# EAGLE design spinner (EAGLE 6.2)
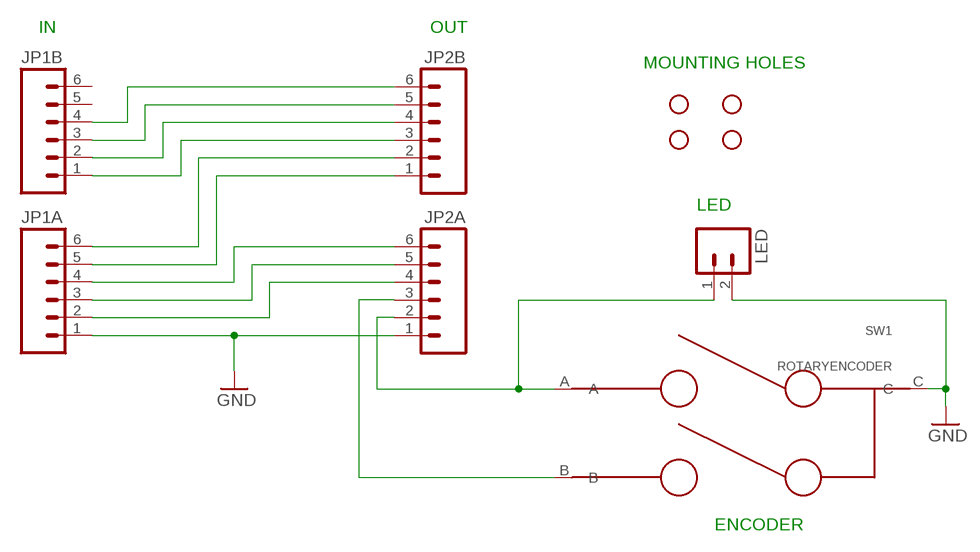
[diagram p0: schematic, sheet 1]

## Parts
JP1A  M06LONGPADS  [1X06_LONGPADS]
JP1B  M06LONGPADS  [1X06_LONGPADS]
JP2A  M06LONGPADS  [1X06_LONGPADS]
JP2B  M06LONGPADS  [1X06_LONGPADS]
JP3  STAND-OFF  [STAND-OFF]
JP4  STAND-OFF  [STAND-OFF]
JP5  STAND-OFF  [STAND-OFF]
JP6  STAND-OFF  [STAND-OFF]
LED  M02PTH3  [1X02_LONGPADS]
SW1  ROTARYENCODER  [EVQV5]

## Nets
GND [ground]: JP1A.1 JP2A.1 LED.2 SW1.C
N$1: JP2A.2 LED.1 SW1.A
N$2: JP1B.4 JP2B.6
N$3: JP1B.3 JP2B.5
N$4: JP1B.2 JP2B.4
N$5: JP1B.1 JP2B.3
N$6: JP1A.6 JP2B.2
N$7: JP1A.5 JP2B.1
N$8: JP1A.4 JP2A.6
N$9: JP1A.3 JP2A.5
N$10: JP1A.2 JP2A.4
N$11: JP2A.3 SW1.B
Unconnected: JP1B.5 JP1B.6

## Notes on the sheet
- IN | OUT
- MOUNTING HOLES
- LED
- ENCODER

## Library data of the parts
JP1A JP1B JP2A JP2B = SparkFun:M06: Header 6 Standard 6-pin 0.1" header. Use with straight break away headers (SKU : PRT-00116), right angle break away headers (PRT-00553), swiss pins (PRT-00743), machine pins (PRT-00117), and female headers (PRT-00115). Molex polarized connector foot print use with SKU : PRT-08094 with associated crimp pins and housings. NOTES ON THE VARIANTS LOCK and LOCK_LONGPADS... This footprint was designed to help hold the alignment of a through-hole component (i.e. 6-pin header) while soldering it into place. You may notice that each hole has been shifted either up or down by 0.005 of an inch from it's more standard position (which is a perfectly straight line). This slight alteration caused the pins (the squares in the middle) to touch the edges of the holes. Because they are alternating, it causes a "brace" to hold the component in place. 0.005 has proven to be the perfect amount of "off-center" position when using our standard breakaway headers. Although looks a little odd when you look at the bare footprint, once you have a header in there, the alteration is very hard to notice. Also, if you push a header all the way into place, it is covered up entirely on the bottom side. This idea of altering the position of holes to aid alignment will be further integrated into the Sparkfun Library for other footprints. It can help hold any component with 3 or more connection pins.
JP3-JP6 = SparkFun:STAND-OFF: Stand Off This is the mechanical footprint for a #4 phillips button head screw. Use the keepout ring to avoid running the screw head into surrounding components. SKU : PRT-00447
LED = SparkFun:M02: Header 2 Standard 2-pin 0.1" header. Use with straight break away headers (SKU : PRT-00116), right angle break away headers (PRT-00553), swiss pins (PRT-00743), machine pins (PRT-00117), and female headers (PRT-00115). Molex polarized connector foot print use with SKU : PRT-08233 with associated crimp pins and housings.
SW1 = spinner:ROTARYENCODER

## Net classes
0 default: width 0.61 mm
1 ground: width 0.813 mm

## Board
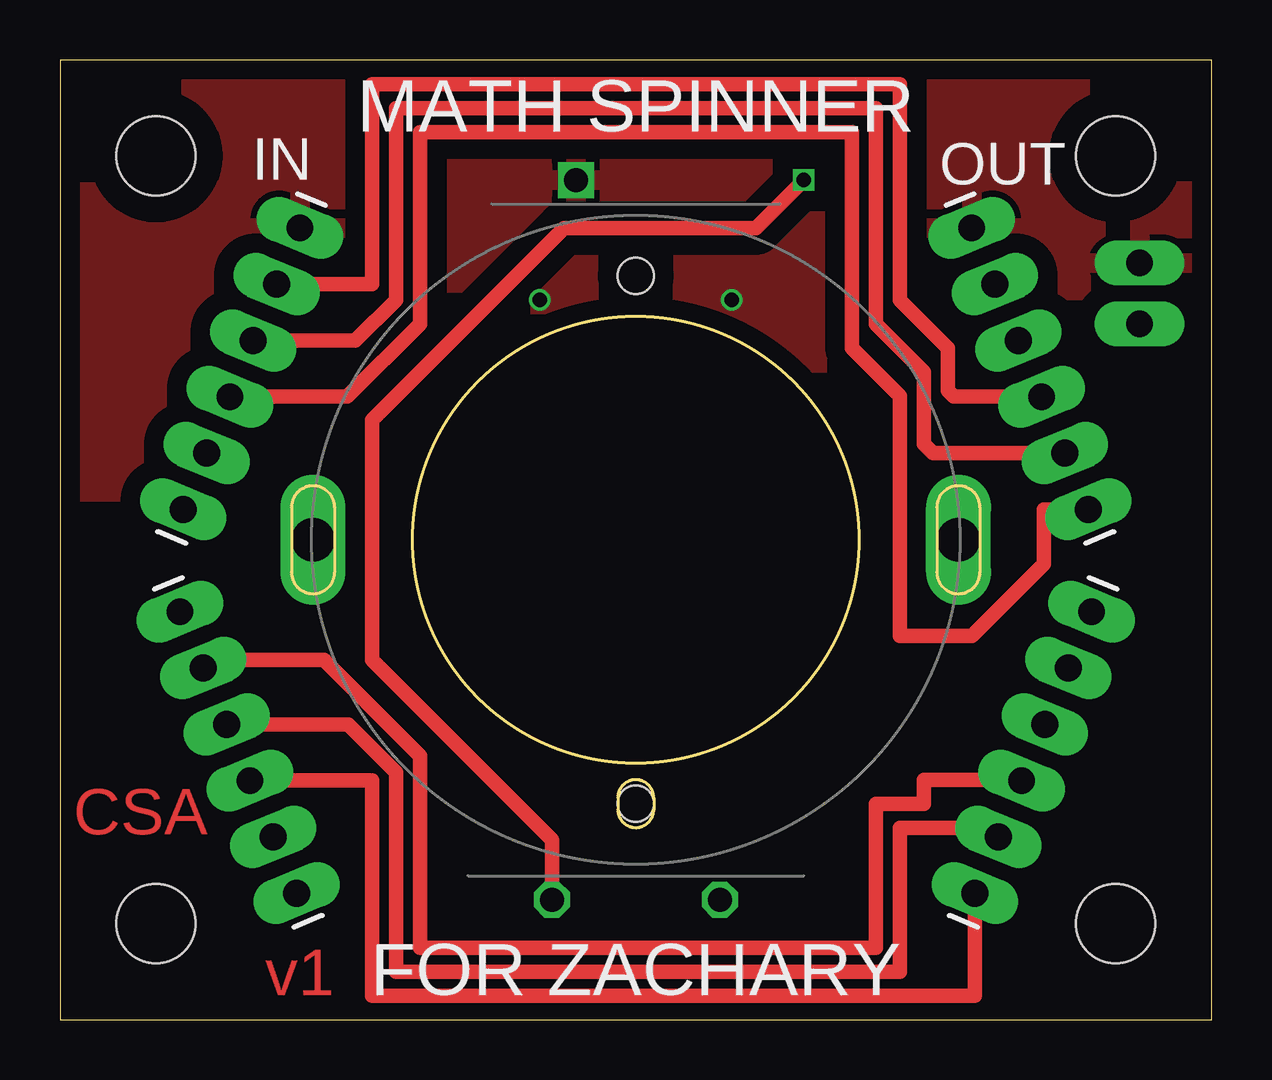
[diagram p1: board, top side]
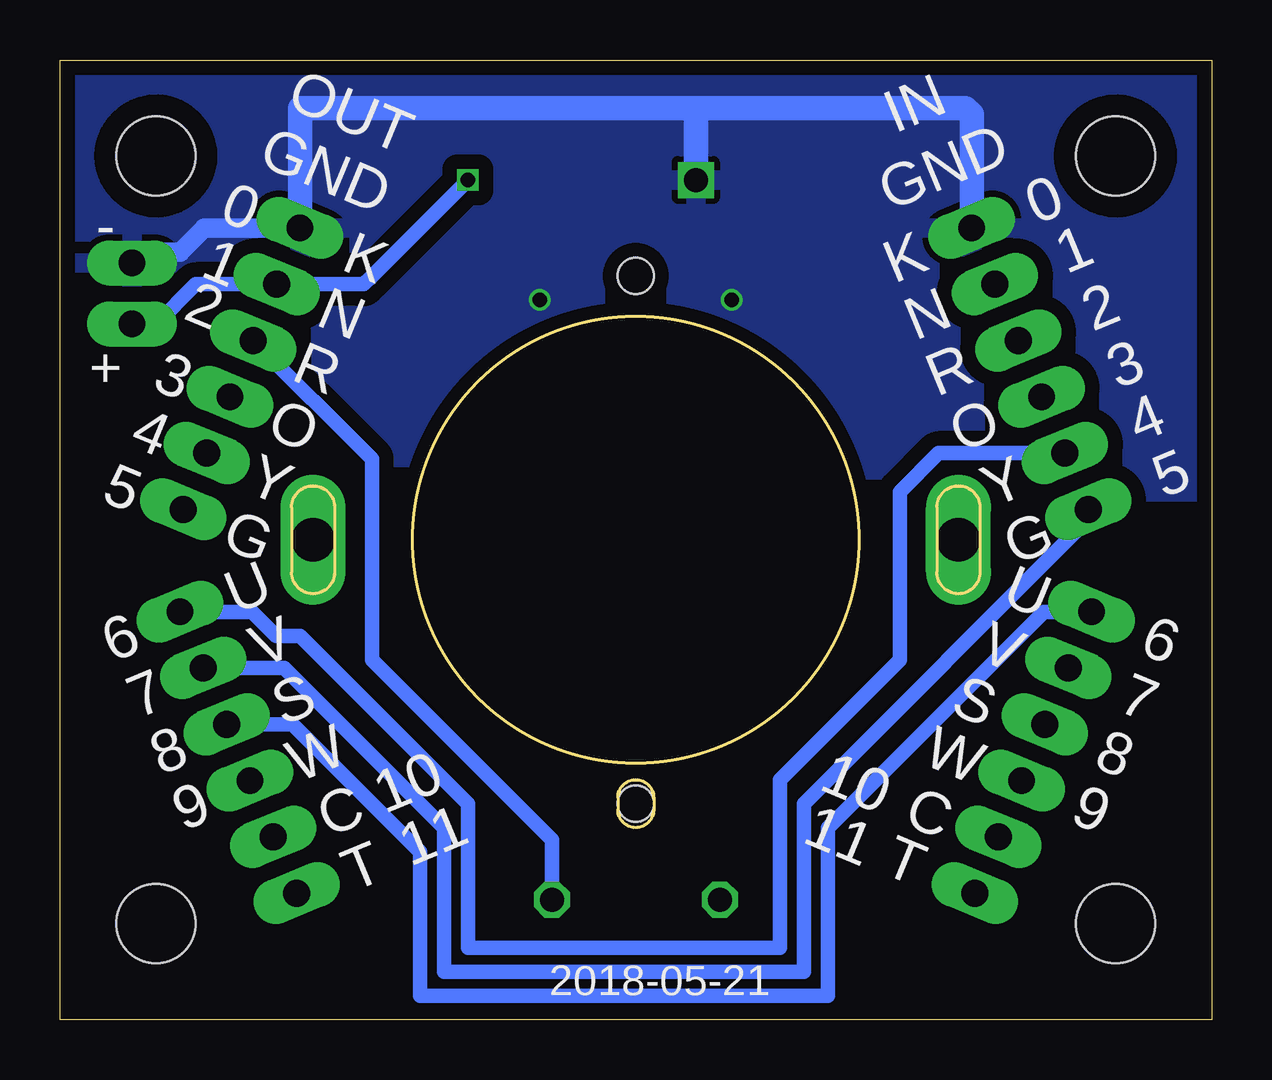
[diagram p2: board, bottom side, seen from below]

Size 48 x 40 mm. Coordinates in mm from the lower left corner, seen from the top.
Outline: 0,0 48,0 48,40 0,40 0,0
Copper layers (1*16): Top 0.035559375mm / dielectric 1.6mm / Bottom 0.035559375mm
Design rules: minimum track width 6mil, minimum drill 10mil, track to track 6mil, track to pad 6mil, pad to pad 6mil, via to via 6mil, smd to smd 6mil, copper to edge 15mil, drill to drill 6mil, minimum pad ring 5mil, minimum via ring 5mil, stop-mask expansion 2.5mil, vias tented up to drill 25mil, thermal gap 10mil
Holes 18.6 mm at 24,20

### Footprints (pad centres in the part's own frame; a part is rotated, then mirrored left to right if it is on the bottom)
1X06_LONGPADS = drill 1.118 pad 1.88 long: 1 0,0; 2 2.54,0; 3 5.08,0; 4 7.62,0; 5 10.16,0; 6 12.7,0
STAND-OFF = hole 3.302: 0,0
1X02_LONGPADS = drill 1.118 pad 1.88 long: 1 0,0; 2 2.54,0
EVQV5 = drill 1 octagon: A -3.5,-15; B 3.5,-15 | drill 1 square: C -2.5,15 | drill 1.8 long: P$1 -13.45,0; P$2 13.45,0 | hole 1.5: 0,11; 0,-11

### Placement (x,y rotation side)
JP1A  10,33 247.5 top
JP1B  5,17 292.5 top
JP2A  38,33 292.5 top
JP2B  43,17 247.5 top
JP3  4,4 0 top
JP4  4,36 0 top
JP5  44,36 0 top
JP6  44,4 0 top
LED  45,29 90 top
SW1  24,20 0 top

### Tracks (layer width: path | path; a pad name or v marks a point on that pad's centre or on a via)
GND  (via drill 0.6)
  Bottom 0.813: JP2A.1 42,33 43,32 44.54,32 LED.2
  Bottom 1.016: SW1.C 21.5,37.75 21.75,38 22,38 | 22,38 38,38 JP2A.1 | JP1A.1 10,37.75 10.25,38 22,38
  other vias: 28,30 20,30
  pour Bottom (isolate 0.61): 0,22 0,40 48,40 48,22
  pour Top (isolate 0.813): 0,22 0,40 48,40 48,22
N$1  (via drill 0.6)
  Top 0.61: SW1.A 20.5,7.5 13,15 13,25 21,33 28,33 29,33 v31,35
  Bottom 0.61: LED.1 44,29 42.35,30.65 JP2A.2 35.35,30.65 35,31 v31,35
N$2
  Top 0.61: JP1B.4 13,9.96 13,1 38.14,1 JP2B.6
N$3
  Top 0.61: JP2B.5 39.11,8 35,8 35,2 14,2 14,10.31 12,12.31 JP1B.3
N$4
  Top 0.61: JP2B.4 40.08,10 36,10 36,9 34,9 34,3 15,3 15,11 13,13 11,15 6.32,15 JP1B.2
N$5
  Bottom 0.61: JP1B.1 7,17 9,15 16,8 16,1 33,1 33,7 38,12 38.31,12.31 JP2B.3
N$6
  Bottom 0.61: JP1A.6 5.14,20.86 17,9 17,2 32,2 32,8 38,14 38.65,14.65 JP2B.2
N$7
  Bottom 0.61: JP1A.5 11.39,23.61 13,22 13,15 18,10 18,3 31,3 31,9 37,15 38,16 39,16 40,17 JP2B.1
N$8
  Top 0.61: JP1A.4 11.96,25.96 15,29 15,37 33,37 33,28 35,26 35,25 35,16 38,16 41,19 41,21.27 JP2A.6
N$9
  Top 0.61: JP1A.3 12.31,28.31 14,30 14,38 34,38 34,29 36,27 36,24 36.39,23.61 JP2A.5
N$10
  Top 0.61: JP1A.2 13,30.65 13,39 35,39 35,30 37,28 37,26.21 37.25,25.96 JP2A.4 40.88,26
N$11
  Bottom 0.61: JP2A.3 35,23.36 35,15 28.5,8.5 27.5,7.5 SW1.B

### Text on the board
Top: CSA | v1
tPlace: MATH SPINNER | IN | OUT | FOR ZACHARY
bPlace: IN | OUT | GND | GND | 0 | 0 | - | 1 | K | K | 1 | 2 | 2 | N | N | 3 | R | R | 3 | + | 4 | O | O | 4 | 5 | Y | Y | 5 | G | G | U | U | 6 | V | V | 6 | 7 | 7 | S | S | 8 | W | W | 8 | 10 | 10 | 9 | C | C | 9 | 11 | 11 | T | T | 2018-05-21